# Altium schematic sheet DISPLAY.SchDoc
size A3; SheetNumber: 3; SheetTotal: 8
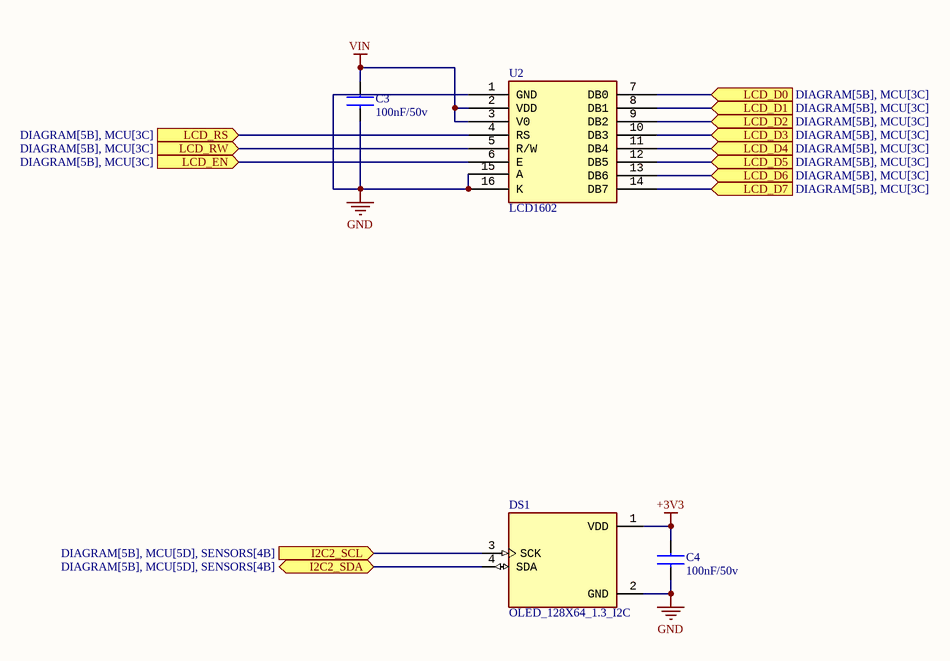
[diagram p0: DISPLAY.SchDoc]

## Parts
C3  100nF/50v  [CAP-CER-0805]
C4  100nF/50v  [CAP-CER-0805]
DS1  OLED_128X64_1.3_I2C  [LCD_OLED_128X64_1.3_I2C]
U2  LCD1602  [LCD16X2]

## Ports
I2C2_SCL (in, see DIAGRAM[5B], MCU[5D], SENSORS[4B]), I2C2_SDA (bidir, see DIAGRAM[5B], MCU[5D], SENSORS[4B]), LCD_D0 (in, see DIAGRAM[5B], MCU[3C]), LCD_D1 (in, see DIAGRAM[5B], MCU[3C]), LCD_D2 (in, see DIAGRAM[5B], MCU[3C]), LCD_D3 (in, see DIAGRAM[5B], MCU[3C]), LCD_D4 (in, see DIAGRAM[5B], MCU[3C]), LCD_D5 (in, see DIAGRAM[5B], MCU[3C]), LCD_D6 (in, see DIAGRAM[5B], MCU[3C]), LCD_D7 (in, see DIAGRAM[5B], MCU[3C]), LCD_EN (in, see DIAGRAM[5B], MCU[3C]), LCD_RS (in, see DIAGRAM[5B], MCU[3C]), LCD_RW (in, see DIAGRAM[5B], MCU[3C])

## Nets
+3V3: C4.2 DS1.1(VDD)
GND: C3.1 C4.1 DS1.2(GND) U2.1(GND) U2.15(A) U2.16(K)
VIN: C3.2 U2.2(VDD) U2.3(V0)
I2C2_SCL: DS1.3(SCK) ; port I2C2_SCL
I2C2_SDA: DS1.4(SDA) ; port I2C2_SDA
LCD_D0: U2.7(DB0) ; port LCD_D0
LCD_D1: U2.8(DB1) ; port LCD_D1
LCD_D2: U2.9(DB2) ; port LCD_D2
LCD_D3: U2.10(DB3) ; port LCD_D3
LCD_D4: U2.11(DB4) ; port LCD_D4
LCD_D5: U2.12(DB5) ; port LCD_D5
LCD_D6: U2.13(DB6) ; port LCD_D6
LCD_D7: U2.14(DB7) ; port LCD_D7
LCD_EN: U2.6(E) ; port LCD_EN
LCD_RS: U2.4(RS) ; port LCD_RS
LCD_RW: U2.5(R/W) ; port LCD_RW

## Library data of the parts
C3 C4 = CAP-CER
DS1 = ID-5: MF: UNIVERSAL-SOLDER Electronics Ltd; MP: OLED 128x64 1.3&quot; I2C; SnapEDA_Link: https://www.snapeda.com/parts/OLED%20128x64%201.3%22%20I2C/UNIVERSAL-SOLDER+Electronics+Ltd/view-part/?ref=snap; Package: None; Value: *; Check_prices: https://www.snapeda.com/parts/OLED%20128x64%201.3%22%20I2C/UNIVERSAL-SOLDER+Electronics+Ltd/view-part/?ref=eda; Design Item ID: ID-5; Mfr# #: OLED_128X64_1.3_I2C